# Altium project project-ui-v1.0.PrjPcb
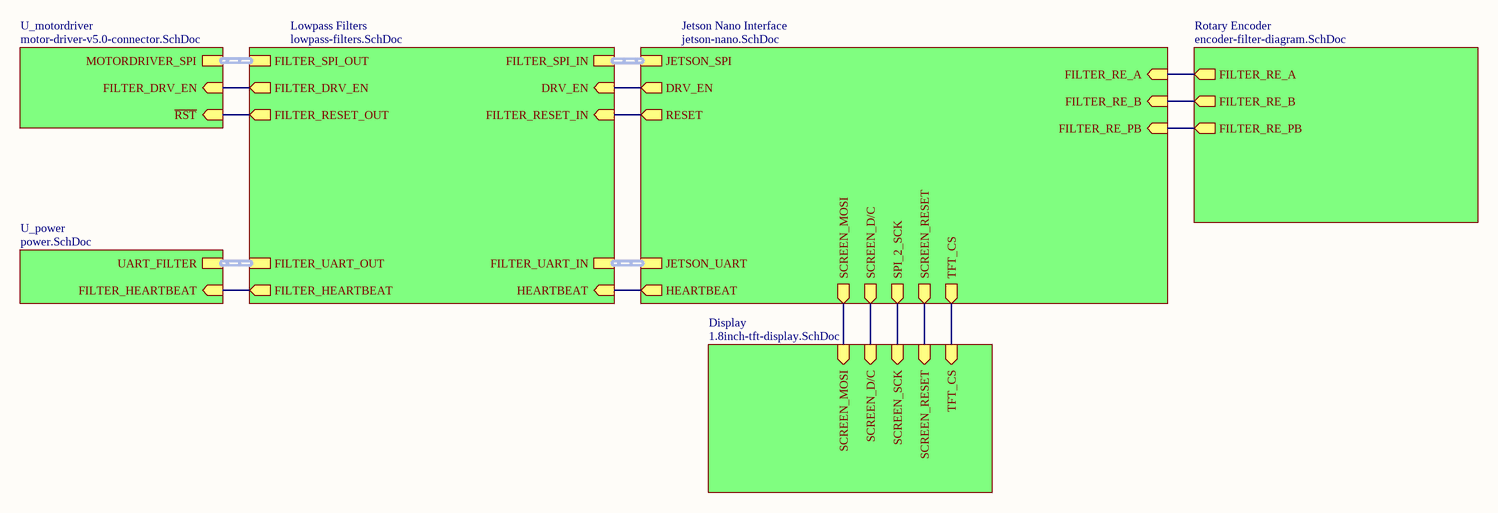
[diagram p0: ui-pcb.SchDoc]
8 sheets, 44 parts. Net scope: hierarchical (ports join the sheet entries above them; power ports are global).
Board file: ui_layout-v1.0.PcbDoc
Sheets:
  ui-pcb.SchDoc
    Jetson Nano Interface = jetson-nano.SchDoc
    Display = 1.8inch-tft-display.SchDoc
    Rotary Encoder = encoder-filter-diagram.SchDoc
    U_power = power.SchDoc
    U_motordriver = motor-driver-v5.0-connector.SchDoc
    Lowpass Filters = lowpass-filters.SchDoc
      U_low-pass-filter_8 = low-pass-filter.SchDoc
      U_low-pass-filter_0 = low-pass-filter.SchDoc
      U_low-pass-filter_1 = low-pass-filter.SchDoc
      U_low-pass-filter_2 = low-pass-filter.SchDoc
      U_low-pass-filter_3 = low-pass-filter.SchDoc
      U_low-pass-filter_4 = low-pass-filter.SchDoc
      U_low-pass-filter_5 = low-pass-filter.SchDoc
      U_low-pass-filter_6 = low-pass-filter.SchDoc
      U_low-pass-filter_7 = low-pass-filter.SchDoc
      U_low-pass-filter_9 = low-pass-filter.SchDoc
      CTRL_EN = low-pass-filter.SchDoc
      U_low-pass-filter_11 = low-pass-filter.SchDoc
      U_low-pass-filter_12 = low-pass-filter.SchDoc
      FILTER_HEARTBEAT = low-pass-filter.SchDoc
      U_low-pass-filter_10 = low-pass-filter.SchDoc

## Sheet ui-pcb.SchDoc
size A4; SheetNumber: 1; SheetTotal: 8

### Sub-sheets
Display = 1.8inch-tft-display.SchDoc: SCREEN_MOSI (in), SCREEN_D/C (in), SCREEN_SCK (in), SCREEN_RESET (in), TFT_CS (in)
Jetson Nano Interface = jetson-nano.SchDoc: JETSON_UART (harness POWER_UART_IN), HEARTBEAT (out), JETSON_SPI (harness MOTORDRIVER_SPI_IN), DRV_EN (out), RESET (out), FILTER_RE_A (in), FILTER_RE_B (in), FILTER_RE_PB (in), SCREEN_MOSI (out), SCREEN_D/C (out), SPI_2_SCK (out), SCREEN_RESET (out), TFT_CS (out)
Lowpass Filters = lowpass-filters.SchDoc: FILTER_SPI_IN (harness MOTORDRIVER_SPI_IN), DRV_EN (in), FILTER_RESET_IN (in), FILTER_SPI_OUT (harness MOTORDRIVER_SPI), FILTER_DRV_EN (out), FILTER_RESET_OUT (out), FILTER_UART_IN (harness POWER_UART_IN), HEARTBEAT (in), FILTER_UART_OUT (harness UART_FILTERED_SIGNALS), FILTER_HEARTBEAT (out)
Rotary Encoder = encoder-filter-diagram.SchDoc: FILTER_RE_PB (out), FILTER_RE_B (out), FILTER_RE_A (out)
U_motordriver = motor-driver-v5.0-connector.SchDoc: MOTORDRIVER_SPI (harness MOTORDRIVER_SPI), ~{RST} (in), FILTER_DRV_EN (in)
U_power = power.SchDoc: UART_FILTER (harness UART_FILTERED_SIGNALS), FILTER_HEARTBEAT (in)

### Nets
DRV_EN: sheet Jetson Nano Interface/DRV_EN, sheet Lowpass Filters/DRV_EN
FILTER_DRV_EN: sheet U_motordriver/FILTER_DRV_EN, sheet Lowpass Filters/FILTER_DRV_EN
FILTER_HEARTBEAT: sheet U_power/FILTER_HEARTBEAT, sheet Lowpass Filters/FILTER_HEARTBEAT
FILTER_IN: sheet Jetson Nano Interface/HEARTBEAT, sheet Lowpass Filters/HEARTBEAT
FILTER_IN: sheet Jetson Nano Interface/RESET, sheet Lowpass Filters/FILTER_RESET_IN  [a separate net that carries the same name]
FILTER_OUT: sheet U_motordriver/~{RST}, sheet Lowpass Filters/FILTER_RESET_OUT
FILTER_RE_A: sheet Jetson Nano Interface/FILTER_RE_A, sheet Rotary Encoder/FILTER_RE_A
FILTER_RE_B: sheet Jetson Nano Interface/FILTER_RE_B, sheet Rotary Encoder/FILTER_RE_B
FILTER_RE_PB: sheet Jetson Nano Interface/FILTER_RE_PB, sheet Rotary Encoder/FILTER_RE_PB
SCREEN_D/C: sheet Jetson Nano Interface/SCREEN_D/C, sheet Display/SCREEN_D/C
SCREEN_MOSI: sheet Jetson Nano Interface/SCREEN_MOSI, sheet Display/SCREEN_MOSI
SCREEN_RESET: sheet Jetson Nano Interface/SCREEN_RESET, sheet Display/SCREEN_RESET
SCREEN_SCK: sheet Jetson Nano Interface/SPI_2_SCK, sheet Display/SCREEN_SCK
TFT_CS: sheet Jetson Nano Interface/TFT_CS, sheet Display/TFT_CS

### Buses and harness runs
harness sheet Jetson Nano Interface/JETSON_SPI = sheet Lowpass Filters/FILTER_SPI_IN
harness sheet Jetson Nano Interface/JETSON_UART = sheet Lowpass Filters/FILTER_UART_IN
harness sheet Lowpass Filters/FILTER_SPI_OUT = sheet U_motordriver/MOTORDRIVER_SPI
harness sheet Lowpass Filters/FILTER_UART_OUT = sheet U_power/UART_FILTER

## Sheet jetson-nano.SchDoc
size A3
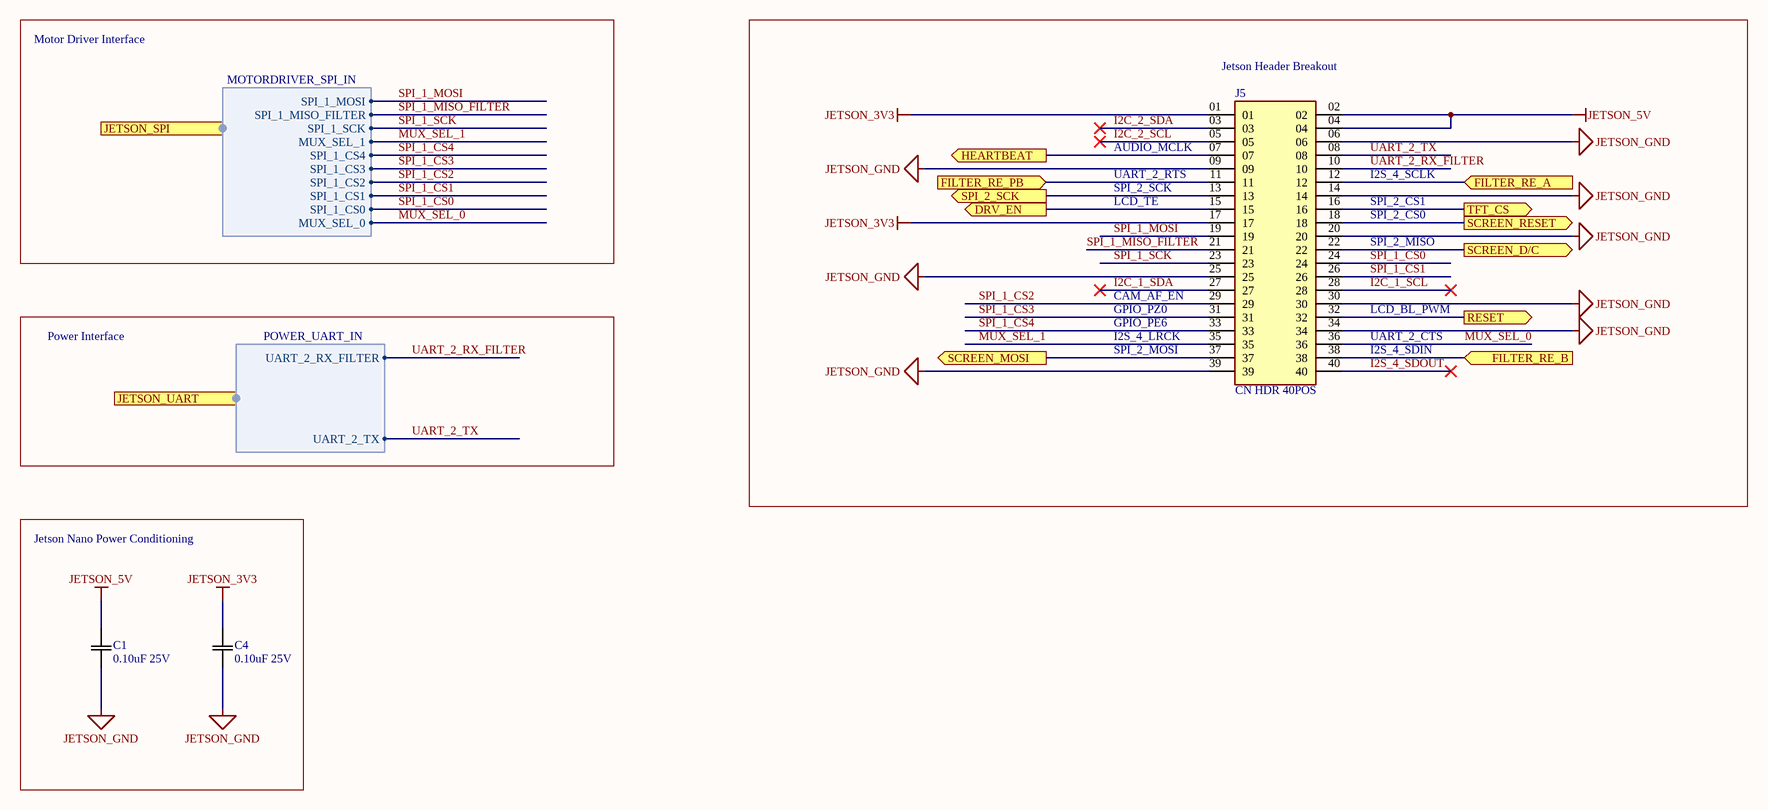
[diagram p1: jetson-nano.SchDoc]

### Parts
C1  0.10uF 25V  [0805]
C4  0.10uF 25V  [0805]
J5  CN HDR 40POS  [CN HDR 40POS 0.1 TH]

### Blocks framed on the sheet
Jetson Nano Power Conditioning: C1 C4

### Ports
DRV_EN (out), FILTER_RE_A (in), FILTER_RE_B (in), FILTER_RE_PB (in), HEARTBEAT (out), JETSON_SPI (harness MOTORDRIVER_SPI_IN), JETSON_UART (harness POWER_UART_IN), RESET (out), SCREEN_D/C (out), SCREEN_MOSI (out), SCREEN_RESET (out), SPI_2_SCK (out), TFT_CS (out)

### Harnesses
MOTORDRIVER_SPI_IN: SPI_1_CS0, MUX_SEL_1, SPI_1_MOSI, SPI_1_MISO_FILTER, SPI_1_CS1, SPI_1_CS2, SPI_1_CS3, SPI_1_CS4, SPI_1_SCK, MUX_SEL_0
POWER_UART_IN: UART_2_TX, UART_2_RX_FILTER

### Nets
JETSON_3V3: C4.2(C2) J5.01 J5.17
JETSON_5V: C1.2(C2) J5.02 J5.04
JETSON_GND: C1.1(C1) C4.1(C1) J5.06 J5.09 J5.14 J5.20 J5.25 J5.30 J5.34 J5.39
DRV_EN: J5.15 ; port DRV_EN
FILTER_IN: J5.07 ; port HEARTBEAT
FILTER_IN: J5.32 ; port RESET  [a separate net that carries the same name]
FILTER_RE_A: J5.12 ; port FILTER_RE_A
FILTER_RE_B: J5.38 ; port FILTER_RE_B
FILTER_RE_PB: J5.11 ; port FILTER_RE_PB
I2C_1_SCL: J5.28
I2C_1_SDA: J5.27
I2C_2_SCL: J5.05
I2C_2_SDA: J5.03
I2S_4_SDOUT: J5.40
MUX_SEL_0: J5.36 ; port JETSON_SPI.MUX_SEL_0
MUX_SEL_1: J5.35 ; port JETSON_SPI.MUX_SEL_1
SCREEN_D/C: J5.22 ; port SCREEN_D/C
SCREEN_MOSI: J5.37 ; port SCREEN_MOSI
SCREEN_RESET: J5.18 ; port SCREEN_RESET
SCREEN_SCK: J5.13 ; port SPI_2_SCK
SPI_1_CS0: J5.24 ; port JETSON_SPI.SPI_1_CS0
SPI_1_CS1: J5.26 ; port JETSON_SPI.SPI_1_CS1
SPI_1_CS2: J5.29 ; port JETSON_SPI.SPI_1_CS2
SPI_1_CS3: J5.31 ; port JETSON_SPI.SPI_1_CS3
SPI_1_CS4: J5.33 ; port JETSON_SPI.SPI_1_CS4
SPI_1_MISO_FILTER: J5.21 ; port JETSON_SPI.SPI_1_MISO_FILTER
SPI_1_MOSI: J5.19 ; port JETSON_SPI.SPI_1_MOSI
SPI_1_SCK: J5.23 ; port JETSON_SPI.SPI_1_SCK
TFT_CS: J5.16 ; port TFT_CS
UART_2_RX_FILTER: J5.10 ; port JETSON_UART.UART_2_RX_FILTER
UART_2_TX: J5.08 ; port JETSON_UART.UART_2_TX

### Notes on the sheet
- Motor Driver Interface
- (near J5) Jetson Header Breakout
- AUDIO_MCLK
- UART_2_RTS
- I2S_4_SCLK
- LCD_TE
- SPI_2_SCK
- SPI_2_CS1
- SPI_2_MISO
- SPI_2_CS0
- GPIO_PZ0
- CAM_AF_EN
- LCD_BL_PWM
- Power Interface
- SPI_2_MOSI
- I2S_4_LRCK
- GPIO_PE6
- I2S_4_SDIN
- UART_2_CTS

### Library data of the parts
C1 C4 = CAP 0.10uF 25V: CAP CER 0.10UF 25V X7R 0805; Value: 0.1uF; Tolerance: 10%; Temperature Coefficient: X7R; Rating: 25V; Part Number: CAP 0.10uF 25V; Operating Temperature: -55°C ~ 125°C
J5 = CN HDR 40POS: 40 Position Header Connector; Part Number: CN HDR 40POS; Supplier 1: Digi-Key; Supplier Part Number 1: S6104-ND; Supplier URL 1: https://www.digikey.ca/en/products/detail/sullins-connector-solutions/PPTC202LFBN-RC/807240?s=N4IgTCBcDaIMoDYCMAGALAWgHIBEQF0BfIA; Pin Count: 40

## Sheet 1.8inch-tft-display.SchDoc
size A4; SheetNumber: 8; SheetTotal: 8
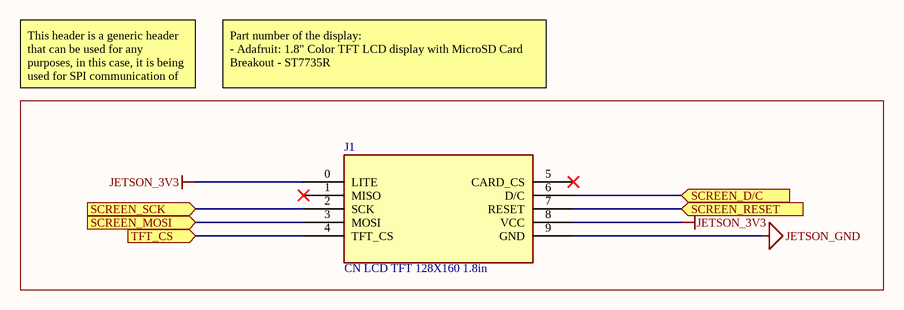
[diagram p2: 1.8inch-tft-display.SchDoc]

### Parts
J1  CN LCD TFT 128X160 1.8in  [CN LCD TFT 128X160 1.8]

### Ports
SCREEN_D/C (in), SCREEN_MOSI (in), SCREEN_RESET (in), SCREEN_SCK (in), TFT_CS (in)

### Nets
JETSON_3V3: J1.0(LITE) J1.8(VCC)
JETSON_GND: J1.9(GND)
SCREEN_D/C: J1.6(D/C) ; port SCREEN_D/C
SCREEN_MOSI: J1.3(MOSI) ; port SCREEN_MOSI
SCREEN_RESET: J1.7(RESET) ; port SCREEN_RESET
SCREEN_SCK: J1.2(SCK) ; port SCREEN_SCK
TFT_CS: J1.4(TFT_CS) ; port TFT_CS

Not connected (* = marked no-connect by the designer): J1 1(MISO)* 5(CARD_CS)*

### Notes on the sheet
- This header is a generic header that can be used for any purposes, in this case, it is being used for SPI communication of the display
- Part number of the display:
  - Adafruit: 1.8" Color TFT LCD display with MicroSD Card Breakout - ST7735R

### Library data of the parts
J1 = CN LCD TFT 128X160 1.8in: Graphic LCD Display Module Transmissive Red, Green, Blue (RGB) TFT - Color SPI 1.8" (45.72mm) 128 x 160; Manufacturer Part Number 1: 358; Part Number: CN LCD TFT 128X160 1.8in; Supplier 1: Digi-Key; Supplier Part Number 1: 1528-1536-ND; Supplier URL 1: https://www.digikey.ca/en/products/detail/adafruit-industries-llc/358/5801368; Pin Count: 10

## Sheet encoder-filter-diagram.SchDoc
size A4; SheetNumber: 9; SheetTotal: 9
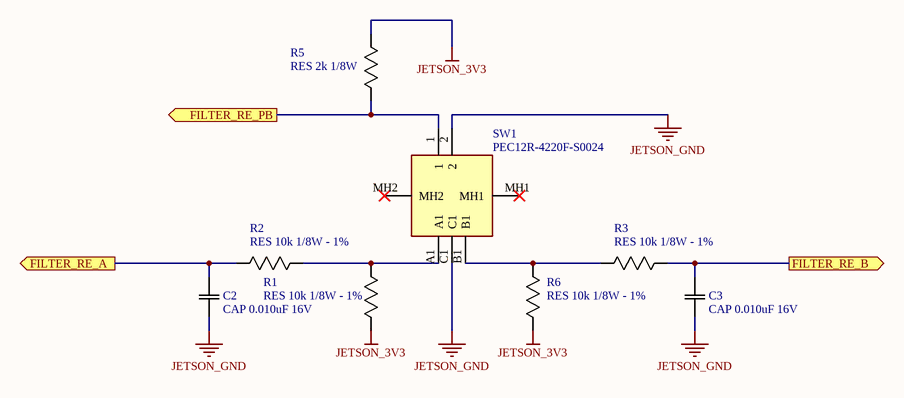
[diagram p3: encoder-filter-diagram.SchDoc]

### Parts
C2  CAP 0.010uF 16V  [0603]
C3  CAP 0.010uF 16V  [0603]
R1  RES 10k 1/8W - 1%  [0603]
R2  RES 10k 1/8W - 1%  [0603]
R3  RES 10k 1/8W - 1%  [0603]
R5  RES 2k 1/8W  [0603]
R6  RES 10k 1/8W - 1%  [0603]
SW1  PEC12R-4220F-S0024  [PEC12R4220FS0024]

### Ports
FILTER_RE_A (out), FILTER_RE_B (out), FILTER_RE_PB (out)

### Nets
JETSON_3V3: R1.2(R2) R5.1(R1) R6.2(R2)
JETSON_GND: C2.1(C1) C3.1(C1) SW1.2 SW1.C1
FILTER_RE_A: C2.2(C2) R2.2(R2) ; port FILTER_RE_A
FILTER_RE_B: C3.2(C2) R3.1(R1) ; port FILTER_RE_B
FILTER_RE_PB: R5.2(R2) SW1.1 ; port FILTER_RE_PB
NetR1_1: R1.1(R1) R2.1(R1) SW1.A1
NetR3_2: R3.2(R2) R6.1(R1) SW1.B1

Not connected (* = marked no-connect by the designer): SW1 MH1* MH2*

### Library data of the parts
C2 C3 = CAP 0.010uF 16V: Default Symbol for Capacitors; Temperature Coefficient: X5R; Tolerance: 10%; Value: 0.010uF; Rating: 16V; Operating Temperature: -55°C ~ 125°C; Part Number: CAP 0.010uF 16V
R1-R3 R6 = RES 10k 1/8W - 1%: Default Resistor Symbol; Value: 1; Power (Watts): 0.125W; Tolerance: 5%; Package: 0805; Part Number: RES 10k 1/8W - 1%
R5 = RES 2k 1/8W: Default Resistor Symbol; Value: 1; Power (Watts): 0.125W; Tolerance: 5%; Package: 0805; Part Number: RES 2k 1/8W
SW1 = PEC12R4220FS0024: Rotary Encoder; Manufacturer_Name: Bourns; Datasheet Link: https://componentsearchengine.com/Datasheets/5/PEC12R-4220F-S0024.pdf; Height: 20mm; Manufacturer_Part_Number: PEC12R-4220F-S0024; Mouser Part Number: 652-PEC12R-4220F-S24; Mouser Price/Stock: https://www.mouser.co.uk/ProductDetail/Bourns/PEC12R-4220F-S0024?qs=Zq5ylnUbLm7u%2FuPQvUoR4Q%3D%3D; Arrow Part Number: PEC12R-4220F-S0024; Arrow Price/Stock: https://www.arrow.com/en/products/pec12r-4220f-s0024/bourns; Part Number: PEC12R4220FS0024; Supplier 1: Digi-key; Supplier Part Number 1: PEC12R-4220F-S0024-ND; Supplier URL 1: https://www.digikey.ca/en/products/detail/bourns-inc/PEC12R-4220F-S0024/4499653

## Sheet power.SchDoc
size A4; SheetNumber: 3; SheetTotal: 4
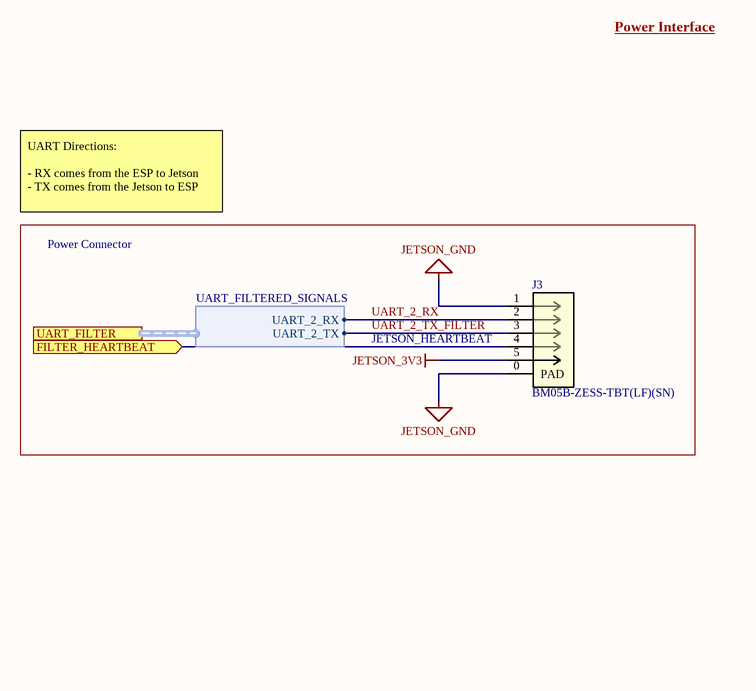
[diagram p4: power.SchDoc]

### Parts
J3  BM05B-ZESS-TBT(LF)(SN)  [JST ZE SMT 5POS]

### Ports
FILTER_HEARTBEAT (in), UART_FILTER (harness UART_FILTERED_SIGNALS)

### Harnesses
UART_FILTERED_SIGNALS: UART_2_TX, UART_2_RX

### Nets
JETSON_3V3: J3.5
JETSON_GND: J3.0(PAD) J3.1
FILTER_HEARTBEAT: J3.4 ; port FILTER_HEARTBEAT
UART_2_RX: J3.2 ; port UART_FILTER.UART_2_RX
UART_2_TX_FILTER: J3.3 ; port UART_FILTER.UART_2_TX

### Notes on the sheet
- Power Interface
- UART Directions:
  - RX comes from the ESP to Jetson
  - TX comes from the Jetson to ESP
- Power Connector
- JETSON_HEARTBEAT

### Library data of the parts
J3 = CN 5POS JST ZE SMT: CONN HEADER VERT SMD 5POS ZE; Part Number: CN 5POS JST ZE SMT; Supplier 1: Digi-Key; Supplier Part Number 1: 455-2383-1-ND; Supplier URL 1: https://www.digikey.ca/en/products/detail/jst-sales-america-inc/BM05B-ZESS-TBT-LF-SN/1886989?s=N4IgTCBcDaIEIFkAMBWOBaAWgUQMq-QBU5CAKAGQDEBKU3AOWpAF0BfIA; Pin Count: 5; Manufacturer Part Number 1: BM05B-ZESS-TBT(LF)(SN)

## Sheet motor-driver-v5.0-connector.SchDoc
size A
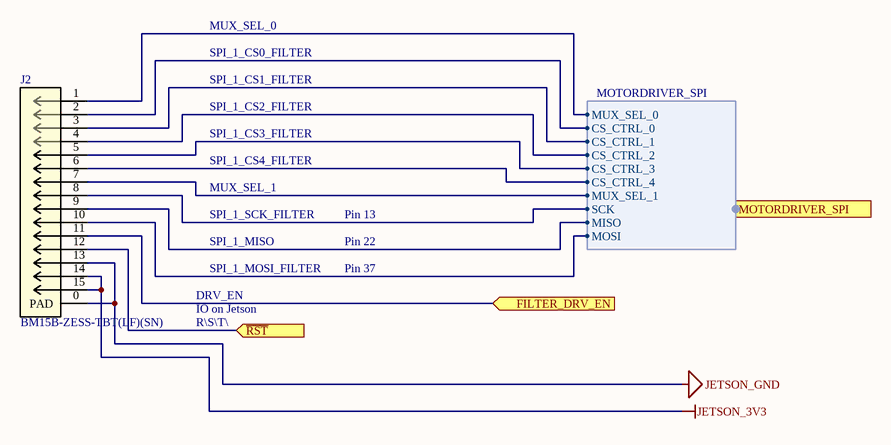
[diagram p5: motor-driver-v5.0-connector.SchDoc]

### Parts
J2  BM15B-ZESS-TBT(LF)(SN)  [JST ZE SMT 15POS]

### Ports
FILTER_DRV_EN (in), MOTORDRIVER_SPI (harness MOTORDRIVER_SPI), ~{RST} (in)

### Harnesses
MOTORDRIVER_SPI: CS_CTRL_0, MUX_SEL_1, SCK, MOSI, MISO, CS_CTRL_1, CS_CTRL_2, CS_CTRL_3, CS_CTRL_4, MUX_SEL_0

### Nets
JETSON_3V3: J2.14 J2.15
JETSON_GND: J2.0(PAD) J2.13
FILTER_DRV_EN: J2.11 ; port FILTER_DRV_EN
FILTER_OUT: J2.12 ; port ~{RST}
MUX_SEL_0_FILTER: J2.1 ; port MOTORDRIVER_SPI.MUX_SEL_0
MUX_SEL_1_FILTER: J2.7 ; port MOTORDRIVER_SPI.MUX_SEL_1
SPI_1_CS0_FILTER: J2.2 ; port MOTORDRIVER_SPI.CS_CTRL_0
SPI_1_CS1_FILTER: J2.3 ; port MOTORDRIVER_SPI.CS_CTRL_1
SPI_1_CS2_FILTER: J2.4 ; port MOTORDRIVER_SPI.CS_CTRL_2
SPI_1_CS3_FILTER: J2.5 ; port MOTORDRIVER_SPI.CS_CTRL_3
SPI_1_CS4_FILTER: J2.6 ; port MOTORDRIVER_SPI.CS_CTRL_4
SPI_1_MISO: J2.9 ; port MOTORDRIVER_SPI.MISO
SPI_1_MOSI_FILTER: J2.10 ; port MOTORDRIVER_SPI.MOSI
SPI_1_SCK_FILTER: J2.8 ; port MOTORDRIVER_SPI.SCK

### Notes on the sheet
- SPI_1_CS0_FILTER
- MUX_SEL_0
- SPI_1_CS1_FILTER
- SPI_1_CS2_FILTER
- SPI_1_CS3_FILTER
- SPI_1_CS4_FILTER
- MUX_SEL_1
- SPI_1_SCK_FILTER
- SPI_1_MISO
- SPI_1_MOSI_FILTER
- Pin 37
- Pin 22
- Pin 13
- IO on Jetson
- DRV_EN
- R\S\T\

### Library data of the parts
J2 = CN 15POS JST ZE SMT: CONN HEADER VERT SMD 15POS ZE; Supplier 1: Digi-Key; Supplier Part Number 1: 455-4211-1-ND; Part Number: CN 15POS JST ZE SMT; Manufacturer Part Number 1: BM15B-ZESS-TBT(LF)(SN); Supplier URL 1: https://www.digikey.ca/en/products/detail/jst-sales-america-inc/BM15B-ZESS-TBT-LF-SN/1886999?s=N4IgTCBcDaIEIFkCMBWOBaAWgUQMq-QBU5CAKAGQDEBKU3AOWpAF0BfIA; Pin Count: 15

## Sheet lowpass-filters.SchDoc
size A3; SheetNumber: 1; SheetTotal: 6
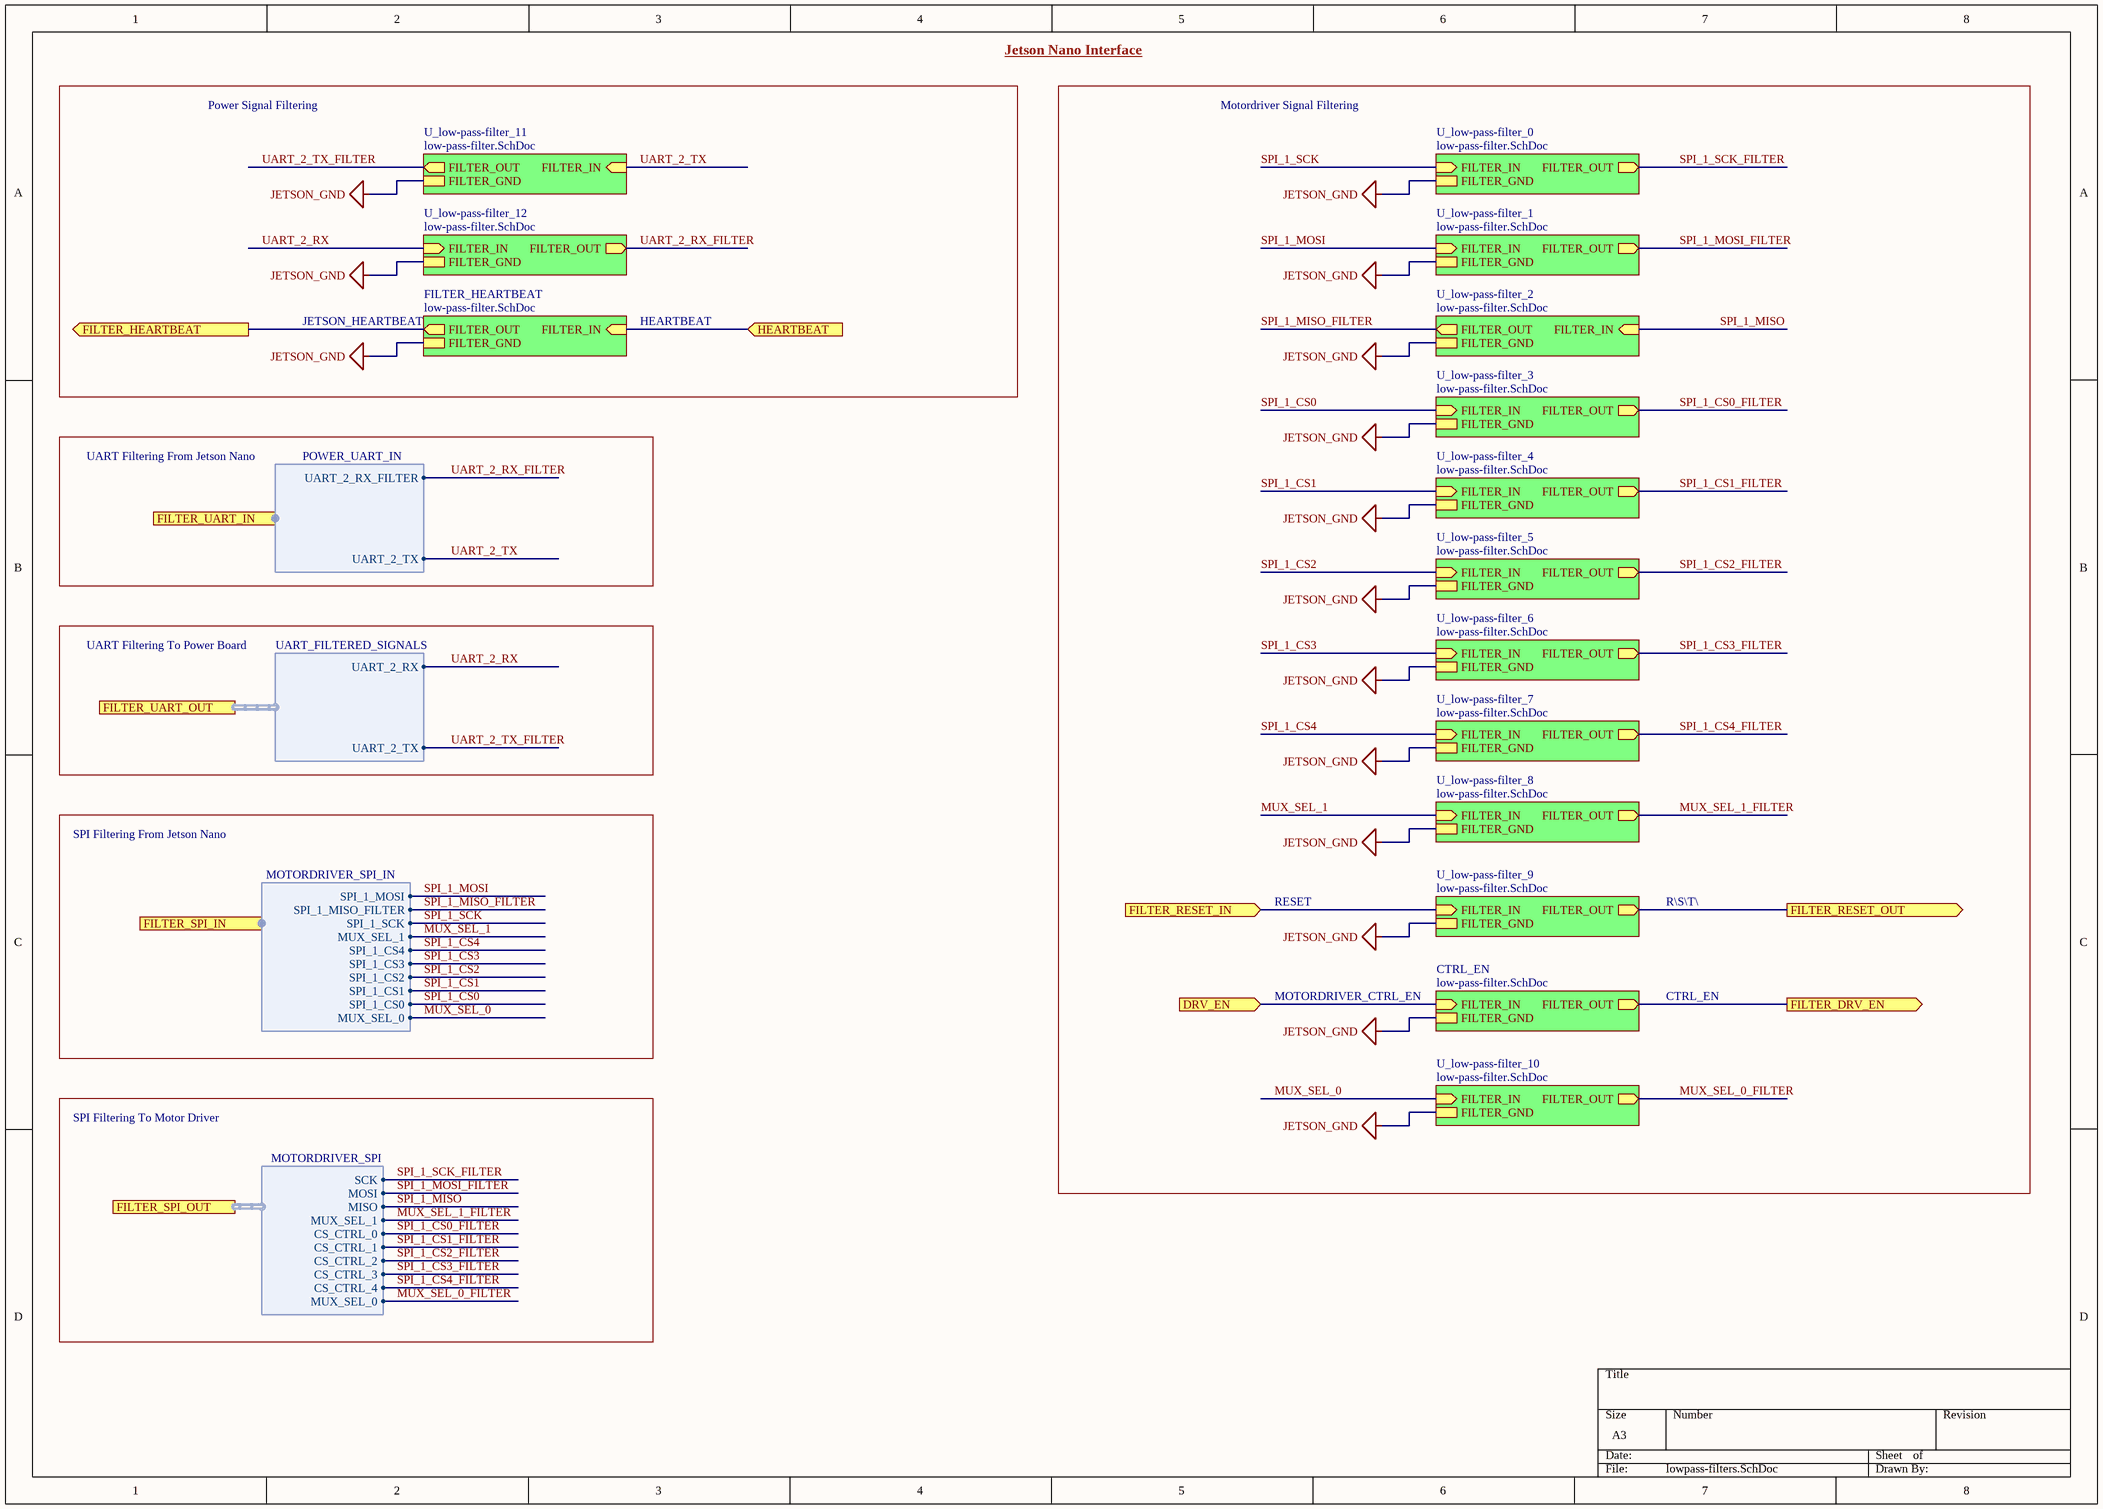
[diagram p6: lowpass-filters.SchDoc]

### Sub-sheets
CTRL_EN = low-pass-filter.SchDoc: FILTER_OUT (out), FILTER_IN (in), FILTER_GND
FILTER_HEARTBEAT = low-pass-filter.SchDoc: FILTER_IN (in), FILTER_OUT (out), FILTER_GND
U_low-pass-filter_0 = low-pass-filter.SchDoc: FILTER_OUT (out), FILTER_IN (in), FILTER_GND
U_low-pass-filter_1 = low-pass-filter.SchDoc: FILTER_OUT (out), FILTER_IN (in), FILTER_GND
U_low-pass-filter_2 = low-pass-filter.SchDoc: FILTER_IN (in), FILTER_OUT (out), FILTER_GND
U_low-pass-filter_3 = low-pass-filter.SchDoc: FILTER_OUT (out), FILTER_IN (in), FILTER_GND
U_low-pass-filter_4 = low-pass-filter.SchDoc: FILTER_OUT (out), FILTER_IN (in), FILTER_GND
U_low-pass-filter_5 = low-pass-filter.SchDoc: FILTER_OUT (out), FILTER_IN (in), FILTER_GND
U_low-pass-filter_6 = low-pass-filter.SchDoc: FILTER_OUT (out), FILTER_IN (in), FILTER_GND
U_low-pass-filter_7 = low-pass-filter.SchDoc: FILTER_OUT (out), FILTER_IN (in), FILTER_GND
U_low-pass-filter_8 = low-pass-filter.SchDoc: FILTER_OUT (out), FILTER_IN (in), FILTER_GND
U_low-pass-filter_9 = low-pass-filter.SchDoc: FILTER_OUT (out), FILTER_IN (in), FILTER_GND
U_low-pass-filter_10 = low-pass-filter.SchDoc: FILTER_OUT (out), FILTER_IN (in), FILTER_GND
U_low-pass-filter_11 = low-pass-filter.SchDoc: FILTER_OUT (out), FILTER_IN (in), FILTER_GND
U_low-pass-filter_12 = low-pass-filter.SchDoc: FILTER_OUT (out), FILTER_IN (in), FILTER_GND

### Ports
DRV_EN (in), FILTER_DRV_EN (out), FILTER_HEARTBEAT (out), FILTER_RESET_IN (in), FILTER_RESET_OUT (out), FILTER_SPI_IN (harness MOTORDRIVER_SPI_IN), FILTER_SPI_OUT (harness MOTORDRIVER_SPI), FILTER_UART_IN (harness POWER_UART_IN), FILTER_UART_OUT (harness UART_FILTERED_SIGNALS), HEARTBEAT (in)

### Harnesses
MOTORDRIVER_SPI_IN: SPI_1_CS0, MUX_SEL_1, SPI_1_SCK, SPI_1_MOSI, SPI_1_MISO_FILTER, SPI_1_CS1, SPI_1_CS2, SPI_1_CS3, SPI_1_CS4, MUX_SEL_0
MOTORDRIVER_SPI: CS_CTRL_0, MUX_SEL_1, SCK, MOSI, MISO, CS_CTRL_1, CS_CTRL_2, CS_CTRL_3, CS_CTRL_4, MUX_SEL_0
UART_FILTERED_SIGNALS: UART_2_TX, UART_2_RX
POWER_UART_IN: UART_2_TX, UART_2_RX_FILTER

### Nets
JETSON_GND: sheet U_low-pass-filter_8/FILTER_GND, sheet U_low-pass-filter_0/FILTER_GND, sheet U_low-pass-filter_1/FILTER_GND, sheet U_low-pass-filter_2/FILTER_GND, sheet U_low-pass-filter_3/FILTER_GND, sheet U_low-pass-filter_4/FILTER_GND, sheet U_low-pass-filter_5/FILTER_GND, sheet U_low-pass-filter_6/FILTER_GND, sheet U_low-pass-filter_7/FILTER_GND, sheet U_low-pass-filter_9/FILTER_GND, sheet CTRL_EN/FILTER_GND, sheet U_low-pass-filter_11/FILTER_GND, sheet U_low-pass-filter_12/FILTER_GND, sheet FILTER_HEARTBEAT/FILTER_GND, sheet U_low-pass-filter_10/FILTER_GND
DRV_EN: port DRV_EN, sheet CTRL_EN/FILTER_IN
FILTER_DRV_EN: port FILTER_DRV_EN, sheet CTRL_EN/FILTER_OUT
FILTER_HEARTBEAT: port FILTER_HEARTBEAT, sheet FILTER_HEARTBEAT/FILTER_OUT
FILTER_IN: port HEARTBEAT, sheet FILTER_HEARTBEAT/FILTER_IN
FILTER_IN: port FILTER_RESET_IN, sheet U_low-pass-filter_9/FILTER_IN  [a separate net that carries the same name]
FILTER_OUT: port FILTER_RESET_OUT, sheet U_low-pass-filter_9/FILTER_OUT
MUX_SEL_0: sheet U_low-pass-filter_10/FILTER_IN, port FILTER_SPI_IN.MUX_SEL_0
MUX_SEL_0_FILTER: sheet U_low-pass-filter_10/FILTER_OUT, port FILTER_SPI_OUT.MUX_SEL_0
MUX_SEL_1: sheet U_low-pass-filter_8/FILTER_IN, port FILTER_SPI_IN.MUX_SEL_1
MUX_SEL_1_FILTER: sheet U_low-pass-filter_8/FILTER_OUT, port FILTER_SPI_OUT.MUX_SEL_1
SPI_1_CS0: sheet U_low-pass-filter_3/FILTER_IN, port FILTER_SPI_IN.SPI_1_CS0
SPI_1_CS0_FILTER: sheet U_low-pass-filter_3/FILTER_OUT, port FILTER_SPI_OUT.CS_CTRL_0
SPI_1_CS1: sheet U_low-pass-filter_4/FILTER_IN, port FILTER_SPI_IN.SPI_1_CS1
SPI_1_CS1_FILTER: sheet U_low-pass-filter_4/FILTER_OUT, port FILTER_SPI_OUT.CS_CTRL_1
SPI_1_CS2: sheet U_low-pass-filter_5/FILTER_IN, port FILTER_SPI_IN.SPI_1_CS2
SPI_1_CS2_FILTER: sheet U_low-pass-filter_5/FILTER_OUT, port FILTER_SPI_OUT.CS_CTRL_2
SPI_1_CS3: sheet U_low-pass-filter_6/FILTER_IN, port FILTER_SPI_IN.SPI_1_CS3
SPI_1_CS3_FILTER: sheet U_low-pass-filter_6/FILTER_OUT, port FILTER_SPI_OUT.CS_CTRL_3
SPI_1_CS4: sheet U_low-pass-filter_7/FILTER_IN, port FILTER_SPI_IN.SPI_1_CS4
SPI_1_CS4_FILTER: sheet U_low-pass-filter_7/FILTER_OUT, port FILTER_SPI_OUT.CS_CTRL_4
SPI_1_MISO: sheet U_low-pass-filter_2/FILTER_IN, port FILTER_SPI_OUT.MISO
SPI_1_MISO_FILTER: sheet U_low-pass-filter_2/FILTER_OUT, port FILTER_SPI_IN.SPI_1_MISO_FILTER
SPI_1_MOSI: sheet U_low-pass-filter_1/FILTER_IN, port FILTER_SPI_IN.SPI_1_MOSI
SPI_1_MOSI_FILTER: sheet U_low-pass-filter_1/FILTER_OUT, port FILTER_SPI_OUT.MOSI
SPI_1_SCK: sheet U_low-pass-filter_0/FILTER_IN, port FILTER_SPI_IN.SPI_1_SCK
SPI_1_SCK_FILTER: sheet U_low-pass-filter_0/FILTER_OUT, port FILTER_SPI_OUT.SCK
UART_2_RX: sheet U_low-pass-filter_12/FILTER_IN, port FILTER_UART_OUT.UART_2_RX
UART_2_RX_FILTER: sheet U_low-pass-filter_12/FILTER_OUT, port FILTER_UART_IN.UART_2_RX_FILTER
UART_2_TX: sheet U_low-pass-filter_11/FILTER_IN, port FILTER_UART_IN.UART_2_TX
UART_2_TX_FILTER: sheet U_low-pass-filter_11/FILTER_OUT, port FILTER_UART_OUT.UART_2_TX

### Notes on the sheet
- Power Signal Filtering
- Jetson Nano Interface
- Motordriver Signal Filtering
- JETSON_HEARTBEAT
- HEARTBEAT
- UART Filtering From Jetson Nano
- UART Filtering To Power Board
- SPI Filtering From Jetson Nano
- RESET
- R\S\T\
- MOTORDRIVER_CTRL_EN
- CTRL_EN
- SPI Filtering To Motor Driver

## Sheet low-pass-filter.SchDoc
size A4
Used 15 times, as channels Lowpass Filters/U_low-pass-filter_8, Lowpass Filters/U_low-pass-filter_0, Lowpass Filters/U_low-pass-filter_1, Lowpass Filters/U_low-pass-filter_2, Lowpass Filters/U_low-pass-filter_3, Lowpass Filters/U_low-pass-filter_4, Lowpass Filters/U_low-pass-filter_5, Lowpass Filters/U_low-pass-filter_6, Lowpass Filters/U_low-pass-filter_7, Lowpass Filters/U_low-pass-filter_9, Lowpass Filters/CTRL_EN, Lowpass Filters/U_low-pass-filter_11, Lowpass Filters/U_low-pass-filter_12, Lowpass Filters/FILTER_HEARTBEAT, Lowpass Filters/U_low-pass-filter_10. Parts and nets are listed once, with the designators drawn on the sheet.
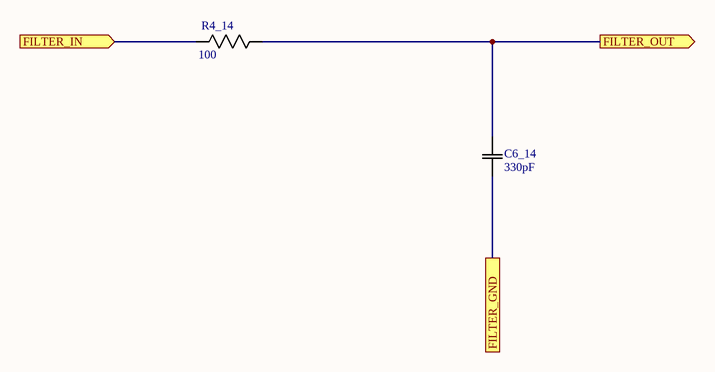
[diagram p7: low-pass-filter.SchDoc]

### Parts
C6_14  330pF  [0805]
R4_14  100  [0805]

### Ports
FILTER_GND, FILTER_IN (in), FILTER_OUT (out)

### Nets
FILTER_GND: C6_14.1(C1) ; port FILTER_GND
FILTER_IN: R4_14.2(R2) ; port FILTER_IN
FILTER_OUT: C6_14.2(C2) R4_14.1(R1) ; port FILTER_OUT

### Channels
Lowpass Filters/U_low-pass-filter_8: designators C6_14=C_MUX1 R4_14=R_MUX1; ports FILTER_GND=JETSON_GND FILTER_IN=MUX_SEL_1 FILTER_OUT=MUX_SEL_1_FILTER
Lowpass Filters/U_low-pass-filter_0: designators C6_14=C_SCK R4_14=R_SCK; ports FILTER_GND=JETSON_GND FILTER_IN=SPI_1_SCK FILTER_OUT=SPI_1_SCK_FILTER
Lowpass Filters/U_low-pass-filter_1: designators C6_14=C_MOSI R4_14=R_MOSI; ports FILTER_GND=JETSON_GND FILTER_IN=SPI_1_MOSI FILTER_OUT=SPI_1_MOSI_FILTER
Lowpass Filters/U_low-pass-filter_2: designators C6_14=C_MISO R4_14=R_MISO; ports FILTER_GND=JETSON_GND FILTER_IN=SPI_1_MISO FILTER_OUT=SPI_1_MISO_FILTER
Lowpass Filters/U_low-pass-filter_3: designators C6_14=C_CS0 R4_14=R_CS0; ports FILTER_GND=JETSON_GND FILTER_IN=SPI_1_CS0 FILTER_OUT=SPI_1_CS0_FILTER
Lowpass Filters/U_low-pass-filter_4: designators C6_14=C_CS1 R4_14=R_CS1; ports FILTER_GND=JETSON_GND FILTER_IN=SPI_1_CS1 FILTER_OUT=SPI_1_CS1_FILTER
Lowpass Filters/U_low-pass-filter_5: designators C6_14=C_CS2 R4_14=R_CS2; ports FILTER_GND=JETSON_GND FILTER_IN=SPI_1_CS2 FILTER_OUT=SPI_1_CS2_FILTER
Lowpass Filters/U_low-pass-filter_6: designators C6_14=C_CS3 R4_14=R_CS3; ports FILTER_GND=JETSON_GND FILTER_IN=SPI_1_CS3 FILTER_OUT=SPI_1_CS3_FILTER
Lowpass Filters/U_low-pass-filter_7: designators C6_14=C_CS4 R4_14=R_CS4; ports FILTER_GND=JETSON_GND FILTER_IN=SPI_1_CS4 FILTER_OUT=SPI_1_CS4_FILTER
Lowpass Filters/U_low-pass-filter_9: designators C6_14=C_RESET R4_14=R_RESET; ports FILTER_GND=JETSON_GND FILTER_IN=FILTER_IN FILTER_OUT=FILTER_OUT
Lowpass Filters/CTRL_EN: designators end in _11; ports FILTER_GND=JETSON_GND FILTER_IN=DRV_EN FILTER_OUT=FILTER_DRV_EN
Lowpass Filters/U_low-pass-filter_11: designators C6_14=C_TX R4_14=R_TX; ports FILTER_GND=JETSON_GND FILTER_IN=UART_2_TX FILTER_OUT=UART_2_TX_FILTER
Lowpass Filters/U_low-pass-filter_12: designators C6_14=C_RX R4_14=R_RX; ports FILTER_GND=JETSON_GND FILTER_IN=UART_2_RX FILTER_OUT=UART_2_RX_FILTER
Lowpass Filters/FILTER_HEARTBEAT: designators C6_14=C_HB R4_14=R_HB; ports FILTER_GND=JETSON_GND FILTER_IN=FILTER_IN FILTER_OUT=FILTER_HEARTBEAT
Lowpass Filters/U_low-pass-filter_10: designators C6_14=C_MUX0 R4_14=R_MUX0; ports FILTER_GND=JETSON_GND FILTER_IN=MUX_SEL_0 FILTER_OUT=MUX_SEL_0_FILTER

### Library data of the parts
C6_14 = CAP 330pF 16V: CAP CER 330PF 16V X5R 0603/0805; Tolerance: 10%; Part Number: CAP 330pF 16V; Value: 330pF; Rating: 16V; Temperature Coefficient: X5R; Package: 0603/0805; Operating Temperature: -55°C ~ 85°C
R4_14 = RES 100.0 1/8W 5%: RES SMD 100 OHM 5% 1/8W 0805; Manufacturer Part Number 1: RK73B1JRTTD101J; Power (Watts): 0.125W; Package: 0805; Value: 100; Tolerance: 5%; Part Number: RES 100.0 1/8W 5%; Supplier 1: Digi-Key; Supplier Part Number 1: 2019-RK73B1JRTTD101JCT-ND; Supplier URL 1: https://www.digikey.ca/en/products/detail/koa-speer-electronics-inc/RK73B1JRTTD101J/12156165?s=N4IgTCBcDaIEoGkDsBmAQgRgFJwCq4BEMAGbAYVxAF0BfIA; Manufacturer Part Number 2: RMCF0805JT100R; Supplier 2: Digi-Key; Supplier Part Number 2: RMCF0805JT100RCT-ND; Supplier URL 2: https://www.digikey.ca/en/products/detail/stackpole-electronics-inc/RMCF0805JT100R/1757756?s=N4IgTCBcDaIEoFkDCAxADADjQVgFIBUBGNNOJfEAXQF8g; Tolerance 2: 5%

## Nets that join several sheets
JETSON_3V3: jetson-nano (C4.2 J5.01 J5.17), 1.8inch-tft-display (J1.0 J1.8), encoder-filter-diagram (R1.2 R5.1 R6.2), power (J3.5), motor-driver-v5.0-connector (J2.14 J2.15)
JETSON_GND: jetson-nano (10 pins), 1.8inch-tft-display (J1.9), encoder-filter-diagram (C2.1 C3.1 SW1.2 SW1.C1), power (J3.0 J3.1), motor-driver-v5.0-connector (J2.0 J2.13), Lowpass Filters/U_low-pass-filter_8 (C_MUX1.1), Lowpass Filters/U_low-pass-filter_0 (C_SCK.1), Lowpass Filters/U_low-pass-filter_1 (C_MOSI.1), Lowpass Filters/U_low-pass-filter_2 (C_MISO.1), Lowpass Filters/U_low-pass-filter_3 (C_CS0.1), Lowpass Filters/U_low-pass-filter_4 (C_CS1.1), Lowpass Filters/U_low-pass-filter_5 (C_CS2.1), Lowpass Filters/U_low-pass-filter_6 (C_CS3.1), Lowpass Filters/U_low-pass-filter_7 (C_CS4.1), Lowpass Filters/U_low-pass-filter_9 (C_RESET.1), Lowpass Filters/CTRL_EN (C6_14_11.1), Lowpass Filters/U_low-pass-filter_11 (C_TX.1), Lowpass Filters/U_low-pass-filter_12 (C_RX.1), Lowpass Filters/FILTER_HEARTBEAT (C_HB.1), Lowpass Filters/U_low-pass-filter_10 (C_MUX0.1)
DRV_EN: jetson-nano (J5.15), Lowpass Filters/CTRL_EN (R4_14_11.2)
FILTER_DRV_EN: motor-driver-v5.0-connector (J2.11), Lowpass Filters/CTRL_EN (C6_14_11.2 R4_14_11.1)
FILTER_HEARTBEAT: power (J3.4), Lowpass Filters/FILTER_HEARTBEAT (C_HB.2 R_HB.1)
FILTER_IN: jetson-nano (J5.07), Lowpass Filters/FILTER_HEARTBEAT (R_HB.2)
FILTER_IN: jetson-nano (J5.32), Lowpass Filters/U_low-pass-filter_9 (R_RESET.2)
FILTER_OUT: motor-driver-v5.0-connector (J2.12), Lowpass Filters/U_low-pass-filter_9 (C_RESET.2 R_RESET.1)
FILTER_RE_A: jetson-nano (J5.12), encoder-filter-diagram (C2.2 R2.2)
FILTER_RE_B: jetson-nano (J5.38), encoder-filter-diagram (C3.2 R3.1)
FILTER_RE_PB: jetson-nano (J5.11), encoder-filter-diagram (R5.2 SW1.1)
MUX_SEL_0: jetson-nano (J5.36), Lowpass Filters/U_low-pass-filter_10 (R_MUX0.2)
MUX_SEL_0_FILTER: motor-driver-v5.0-connector (J2.1), Lowpass Filters/U_low-pass-filter_10 (C_MUX0.2 R_MUX0.1)
MUX_SEL_1: jetson-nano (J5.35), Lowpass Filters/U_low-pass-filter_8 (R_MUX1.2)
MUX_SEL_1_FILTER: motor-driver-v5.0-connector (J2.7), Lowpass Filters/U_low-pass-filter_8 (C_MUX1.2 R_MUX1.1)
SCREEN_D/C: jetson-nano (J5.22), 1.8inch-tft-display (J1.6)
SCREEN_MOSI: jetson-nano (J5.37), 1.8inch-tft-display (J1.3)
SCREEN_RESET: jetson-nano (J5.18), 1.8inch-tft-display (J1.7)
SCREEN_SCK: jetson-nano (J5.13), 1.8inch-tft-display (J1.2)
SPI_1_CS0: jetson-nano (J5.24), Lowpass Filters/U_low-pass-filter_3 (R_CS0.2)
SPI_1_CS0_FILTER: motor-driver-v5.0-connector (J2.2), Lowpass Filters/U_low-pass-filter_3 (C_CS0.2 R_CS0.1)
SPI_1_CS1: jetson-nano (J5.26), Lowpass Filters/U_low-pass-filter_4 (R_CS1.2)
SPI_1_CS1_FILTER: motor-driver-v5.0-connector (J2.3), Lowpass Filters/U_low-pass-filter_4 (C_CS1.2 R_CS1.1)
SPI_1_CS2: jetson-nano (J5.29), Lowpass Filters/U_low-pass-filter_5 (R_CS2.2)
SPI_1_CS2_FILTER: motor-driver-v5.0-connector (J2.4), Lowpass Filters/U_low-pass-filter_5 (C_CS2.2 R_CS2.1)
SPI_1_CS3: jetson-nano (J5.31), Lowpass Filters/U_low-pass-filter_6 (R_CS3.2)
SPI_1_CS3_FILTER: motor-driver-v5.0-connector (J2.5), Lowpass Filters/U_low-pass-filter_6 (C_CS3.2 R_CS3.1)
SPI_1_CS4: jetson-nano (J5.33), Lowpass Filters/U_low-pass-filter_7 (R_CS4.2)
SPI_1_CS4_FILTER: motor-driver-v5.0-connector (J2.6), Lowpass Filters/U_low-pass-filter_7 (C_CS4.2 R_CS4.1)
SPI_1_MISO: motor-driver-v5.0-connector (J2.9), Lowpass Filters/U_low-pass-filter_2 (R_MISO.2)
SPI_1_MISO_FILTER: jetson-nano (J5.21), Lowpass Filters/U_low-pass-filter_2 (C_MISO.2 R_MISO.1)
SPI_1_MOSI: jetson-nano (J5.19), Lowpass Filters/U_low-pass-filter_1 (R_MOSI.2)
SPI_1_MOSI_FILTER: motor-driver-v5.0-connector (J2.10), Lowpass Filters/U_low-pass-filter_1 (C_MOSI.2 R_MOSI.1)
SPI_1_SCK: jetson-nano (J5.23), Lowpass Filters/U_low-pass-filter_0 (R_SCK.2)
SPI_1_SCK_FILTER: motor-driver-v5.0-connector (J2.8), Lowpass Filters/U_low-pass-filter_0 (C_SCK.2 R_SCK.1)
TFT_CS: jetson-nano (J5.16), 1.8inch-tft-display (J1.4)
UART_2_RX: power (J3.2), Lowpass Filters/U_low-pass-filter_12 (R_RX.2)
UART_2_RX_FILTER: jetson-nano (J5.10), Lowpass Filters/U_low-pass-filter_12 (C_RX.2 R_RX.1)
UART_2_TX: jetson-nano (J5.08), Lowpass Filters/U_low-pass-filter_11 (R_TX.2)
UART_2_TX_FILTER: power (J3.3), Lowpass Filters/U_low-pass-filter_11 (C_TX.2 R_TX.1)

## Assembly variants
C01: not fitted C6_1 C6_2 C6_3 C6_4 C6_5 C6_6 C6_7 C6_8 C6_9 C6_10 C6_11 C6_12 C6_13 C6_14